# EasyEDA Pro project pcb.eprj

# Schematic Schematic1
Create Date: 2023-02-15; Page Name: P1; Project Name: pcb; Schematic Name: Schematic1; Update Date: 2023-03-15; Company: Shang Wentao; Page Size: A4; Version: V2.0
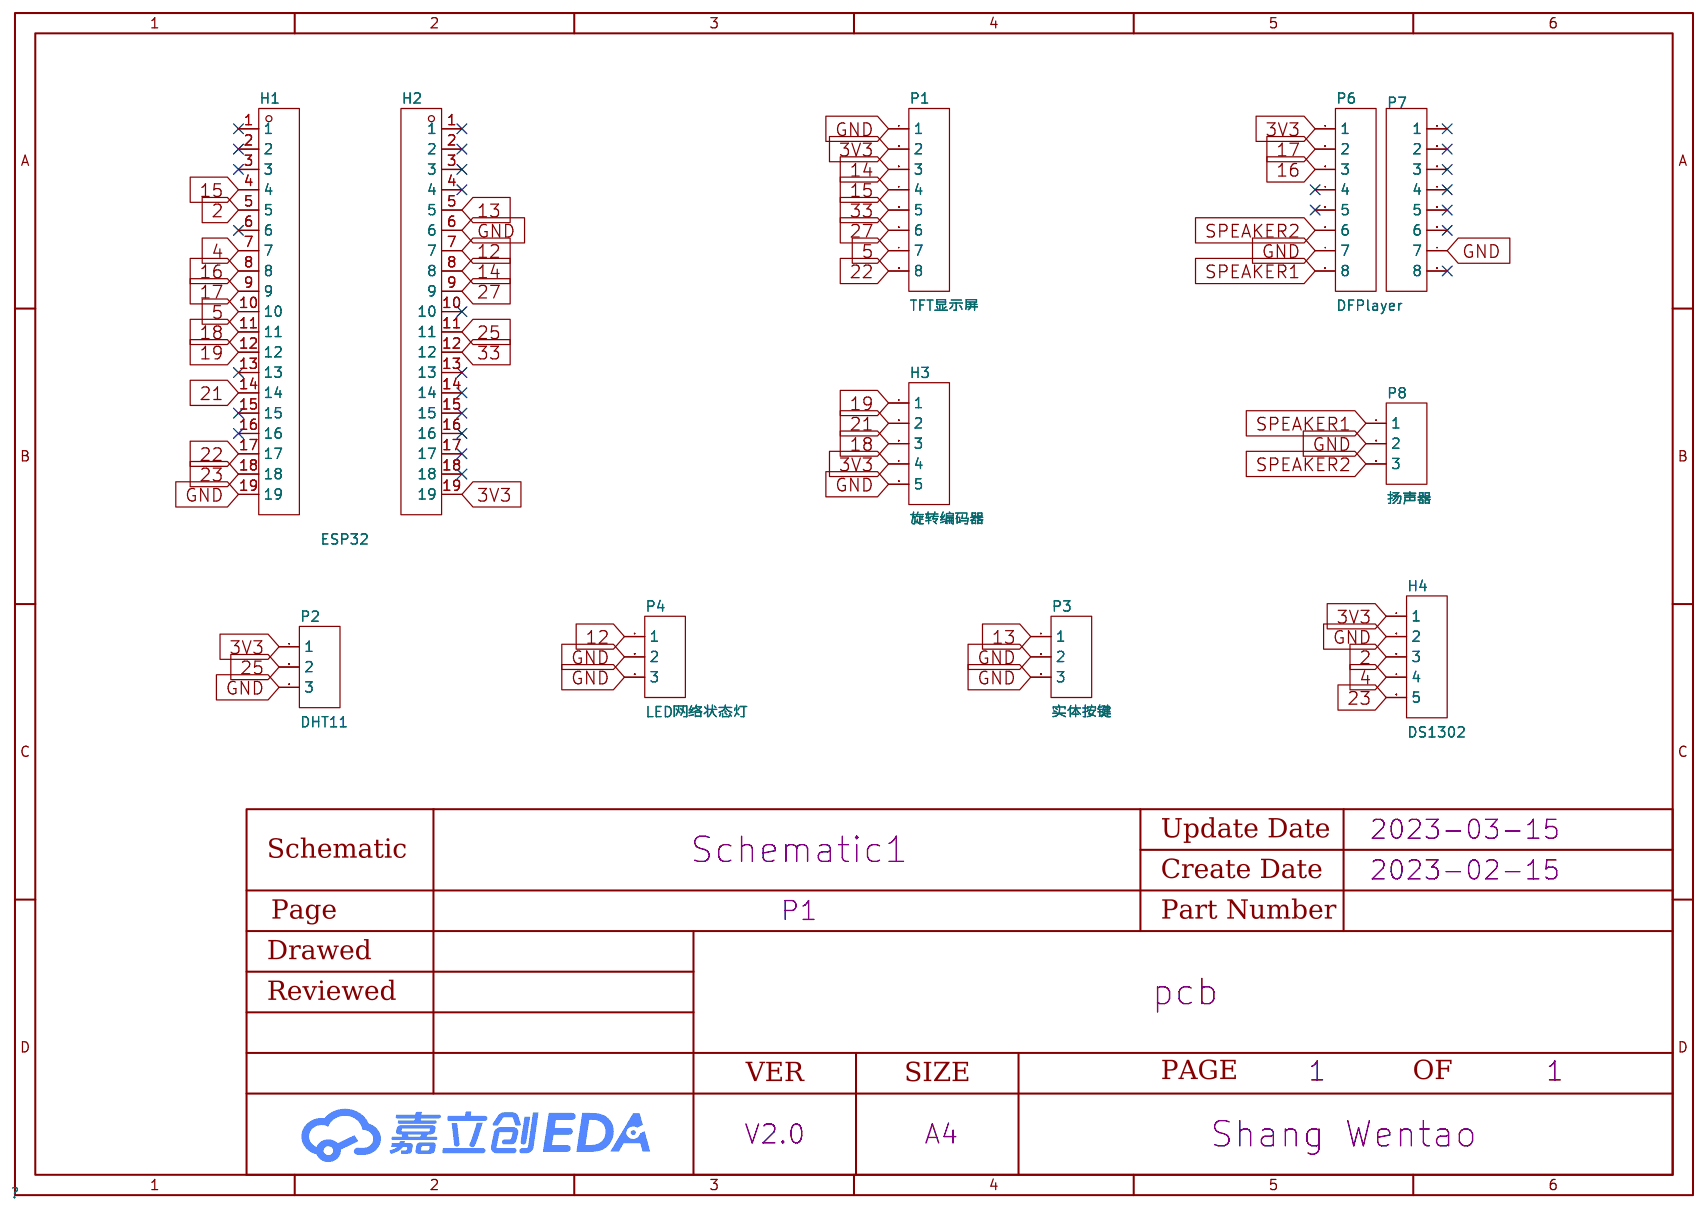
[diagram p0: schematic sheet]

## Parts
H1  ESP32  [HDR-TH_19P-P2.54-V-F]
H2  ESP32  [HDR-TH_19P-P2.54-V-F]
H3  旋转编码器  [HDR-TH_5P-P2.54-V-F]
H4  DS1302  [HDR-TH_5P-P2.54-V-F]
P1  TFT显示屏  [HDR-TH_8P-P2.54-V-F-1]
P2  DHT11  [HDR-TH_3P-P2.54-V-F]
P3  实体按键  [HDR-TH_3P-P2.54-V-F]
P4  LED网络状态灯  [HDR-TH_3P-P2.54-V-F]
P6  DFPlayer  [HDR-TH_8P-P2.54-V-F-1]
P7  2.54-1*8P母环保  [HDR-TH_8P-P2.54-V-F-1]
P8  扬声器  [HDR-TH_3P-P2.54-V-F]

## Library data of the parts
H1 H2 = 2.54-1*19P母: 排数:单排;总孔位数:19;间距:2.54mm;行距:-;安装类型:直插;塑高:-;触头材质:-;触头镀层:-;; LCSC Part Name: 2.54mm; Supplier Part: C319202; Manufacturer: BOOMELE(博穆精密); Supplier Footprint: 插件,P=2.54mm; JLCPCB Part Class: 扩展库; Supplier: LCSC; Number of Rows: 单排; Number of Holes: 19; Pitch: 2.54mm; Mounting Type: 直插
H3 H4 = 2.54-1*5P母: 排数:单排;总孔位数:5;间距:2.54mm;插孔结构:1x5P;行距:-;安装类型:直插;塑高:-;触头材质:-;触头镀层:-;; LCSC Part Name: 2.54mm 1x5P; Supplier Part: C50950; Manufacturer: BOOMELE(博穆精密); Supplier Footprint: 插件,P=2.54mm; JLCPCB Part Class: 扩展库; Datasheet: https://atta.szlcsc.com/upload/public/pdf/source/20151109/1457707571406.pdf; Supplier: LCSC; Number of Rows: 单排; Number of Holes: 5; Pitch: 2.54mm; Holes Structure: 1x5P; Mounting Type: 直插
P1 P6 P7 = 2.54-1*8P母环保: 排数:单排;总孔位数:8;间距:2.54mm;插孔结构:1x8P;行距:-;安装类型:直插;塑高:-;触头材质:-;触头镀层:-;; LCSC Part Name: 2.54mm 1x8P; Supplier Part: C27438; Manufacturer: BOOMELE(博穆精密); Supplier Footprint: 插件,P=2.54mm; JLCPCB Part Class: 扩展库; Datasheet: https://atta.szlcsc.com/upload/public/pdf/source/20151109/1457707554453.pdf; Supplier: LCSC; Number of Rows: 单排; Number of Holes: 8; Pitch: 2.54mm; Holes Structure: 1x8P; Mounting Type: 直插
P2-P4 P8 = 2.54-1*3P母: 排数:单排;总孔位数:3;间距:2.54mm;行距:-;安装类型:直插;塑高:-;触头材质:-;触头镀层:金;; LCSC Part Name: 2.54mm 环保镀金; Supplier Part: C146243; Manufacturer: BOOMELE(博穆精密); Supplier Footprint: 插件,P=2.54mm; JLCPCB Part Class: 扩展库; Supplier: LCSC; Number of Rows: 单排; Number of Holes: 3; Pitch: 2.54mm; Mounting Type: 直插; Contact Plating: 金

## Nets
3V3: H2.19 H3.4 H4.1 P1.2 P2.1 P6.1
GND: H1.19 H2.6 H3.5 H4.2 P1.1 P2.3 P3.2 P3.3 P4.2 P4.3 P6.7 P7.7 P8.2
2: H1.5 H4.3
4: H1.7 H4.4
5: H1.10 P1.7
12: H2.7 P4.1
13: H2.5 P3.1
14: H2.8 P1.3
15: H1.4 P1.4
16: H1.8 P6.3
17: H1.9 P6.2
18: H1.11 H3.3
19: H1.12 H3.1
21: H1.14 H3.2
22: H1.17 P1.8
23: H1.18 H4.5
25: H2.11 P2.2
27: H2.9 P1.6
33: H2.12 P1.5
SPEAKER1: P6.8 P8.1
SPEAKER2: P6.6 P8.3

Not connected (* = marked no-connect by the designer): H1 1* 2* 3* 6* 13* 15* 16*; H2 1* 2* 3* 4* 10* 13* 14* 15* 16* 17* 18*; P6 4* 5*; P7 1* 2* 3* 4* 5* 6* 8*

# Board PCB1
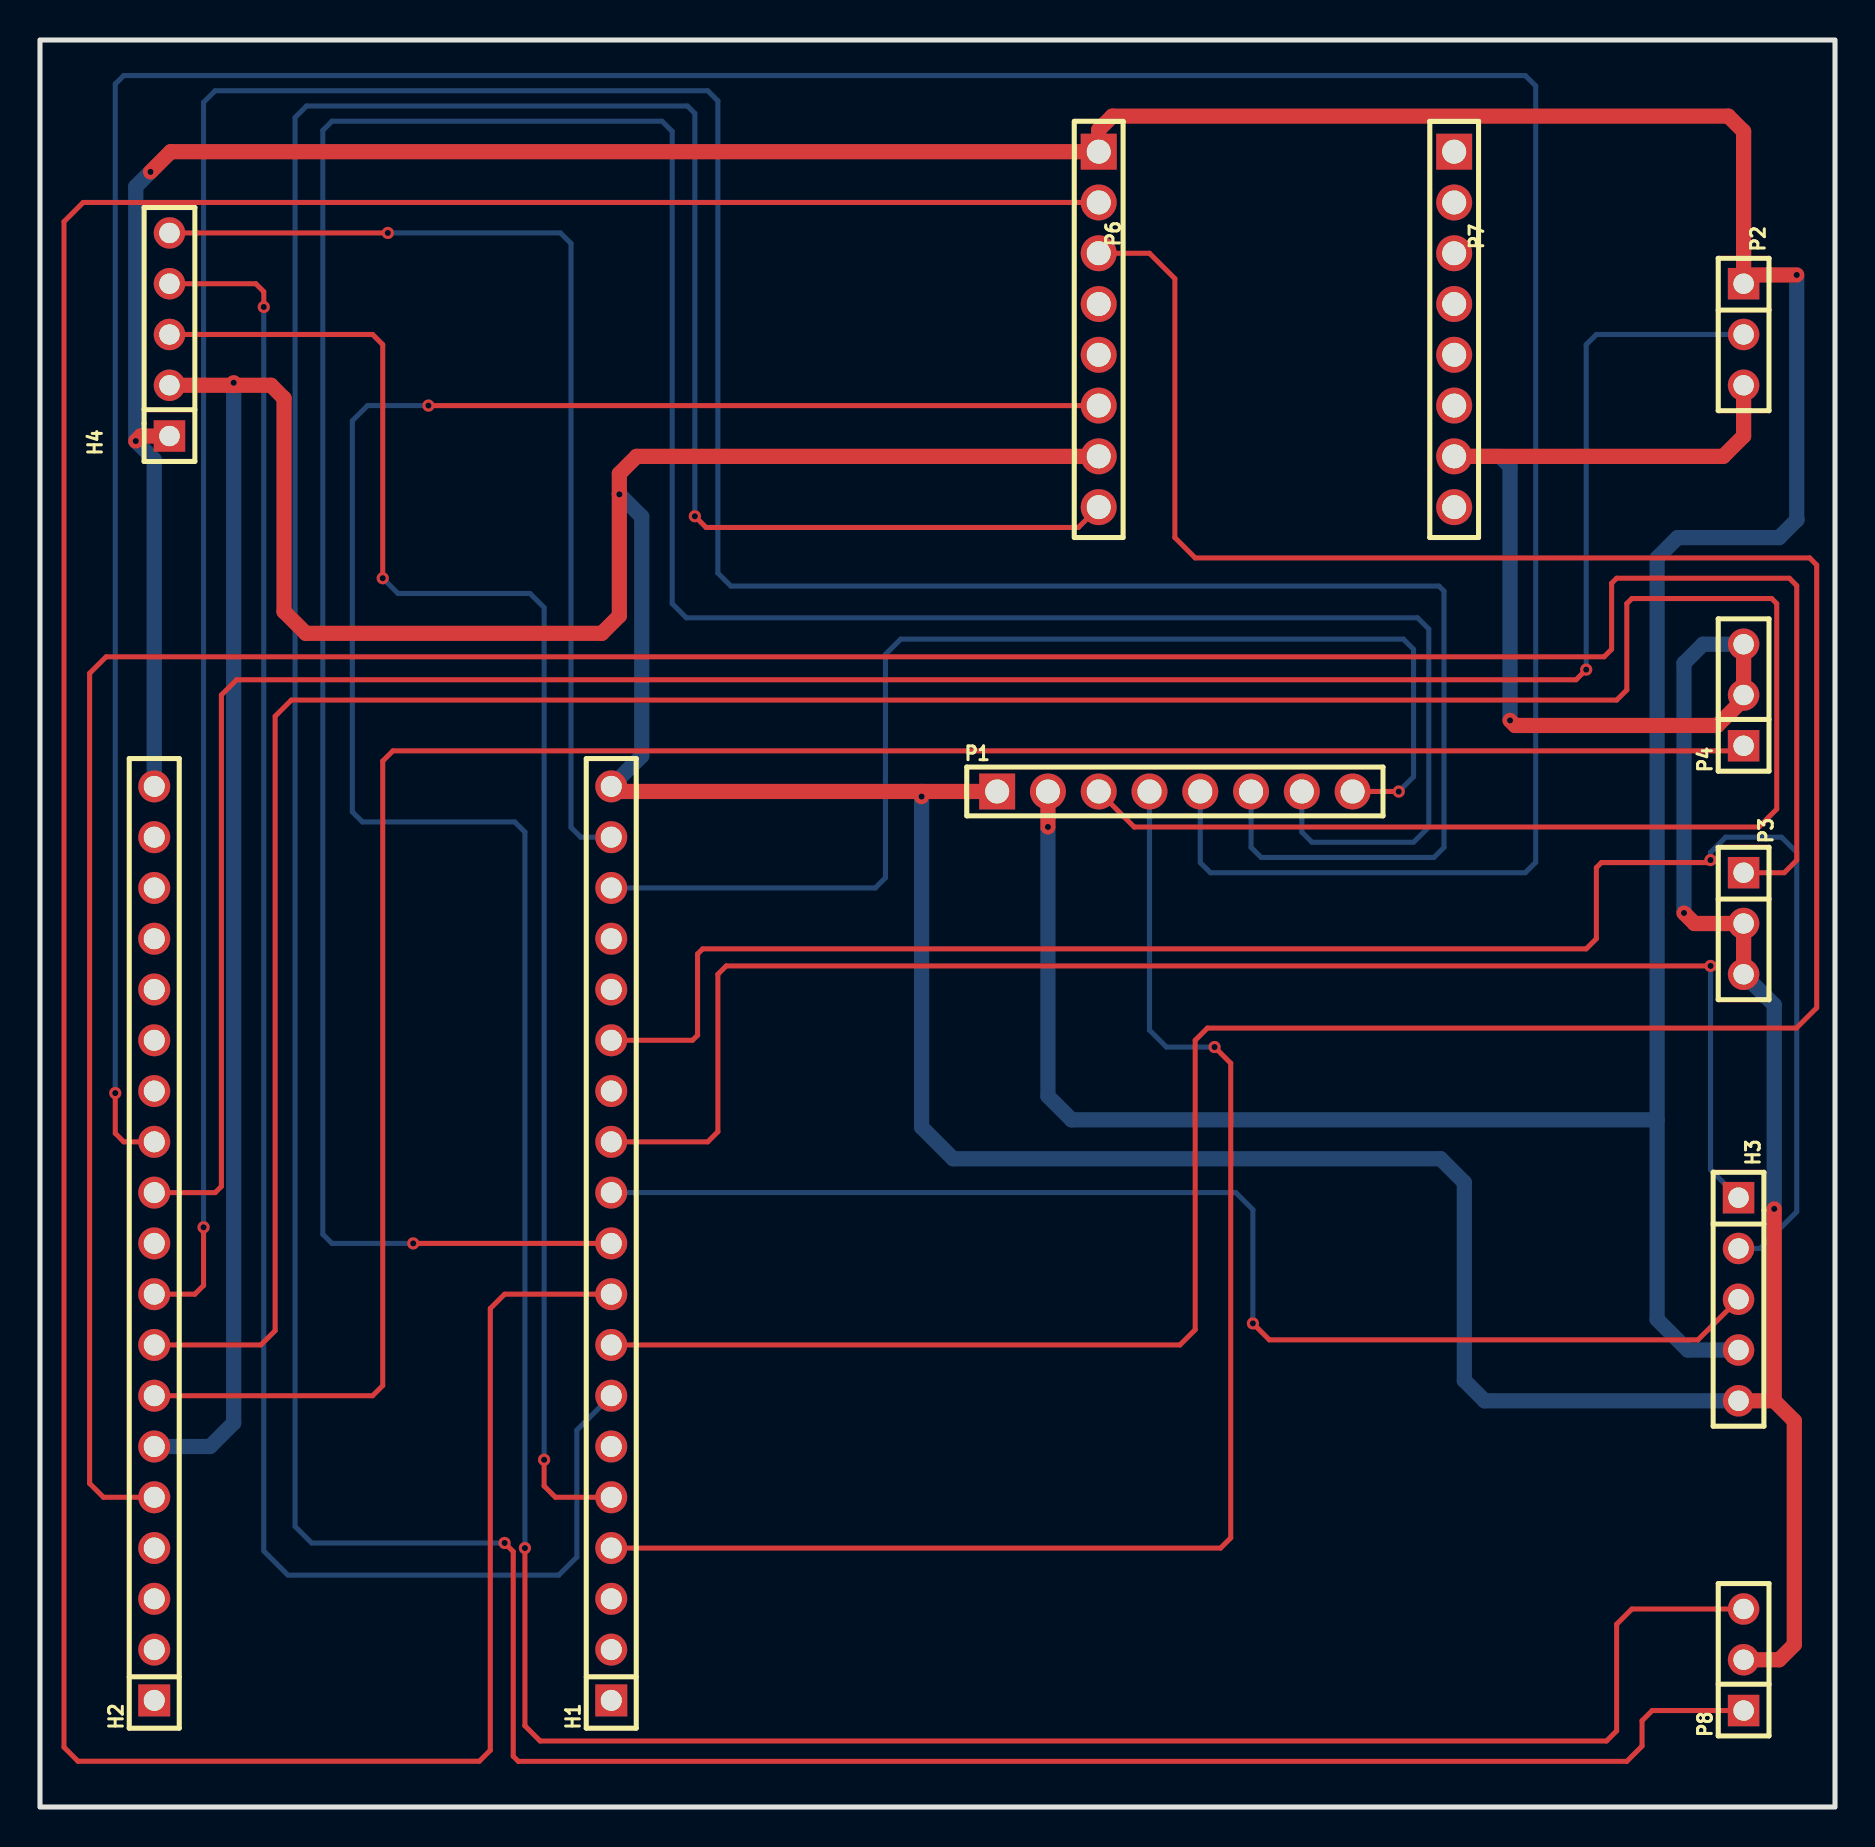
[diagram p1: board, top side]
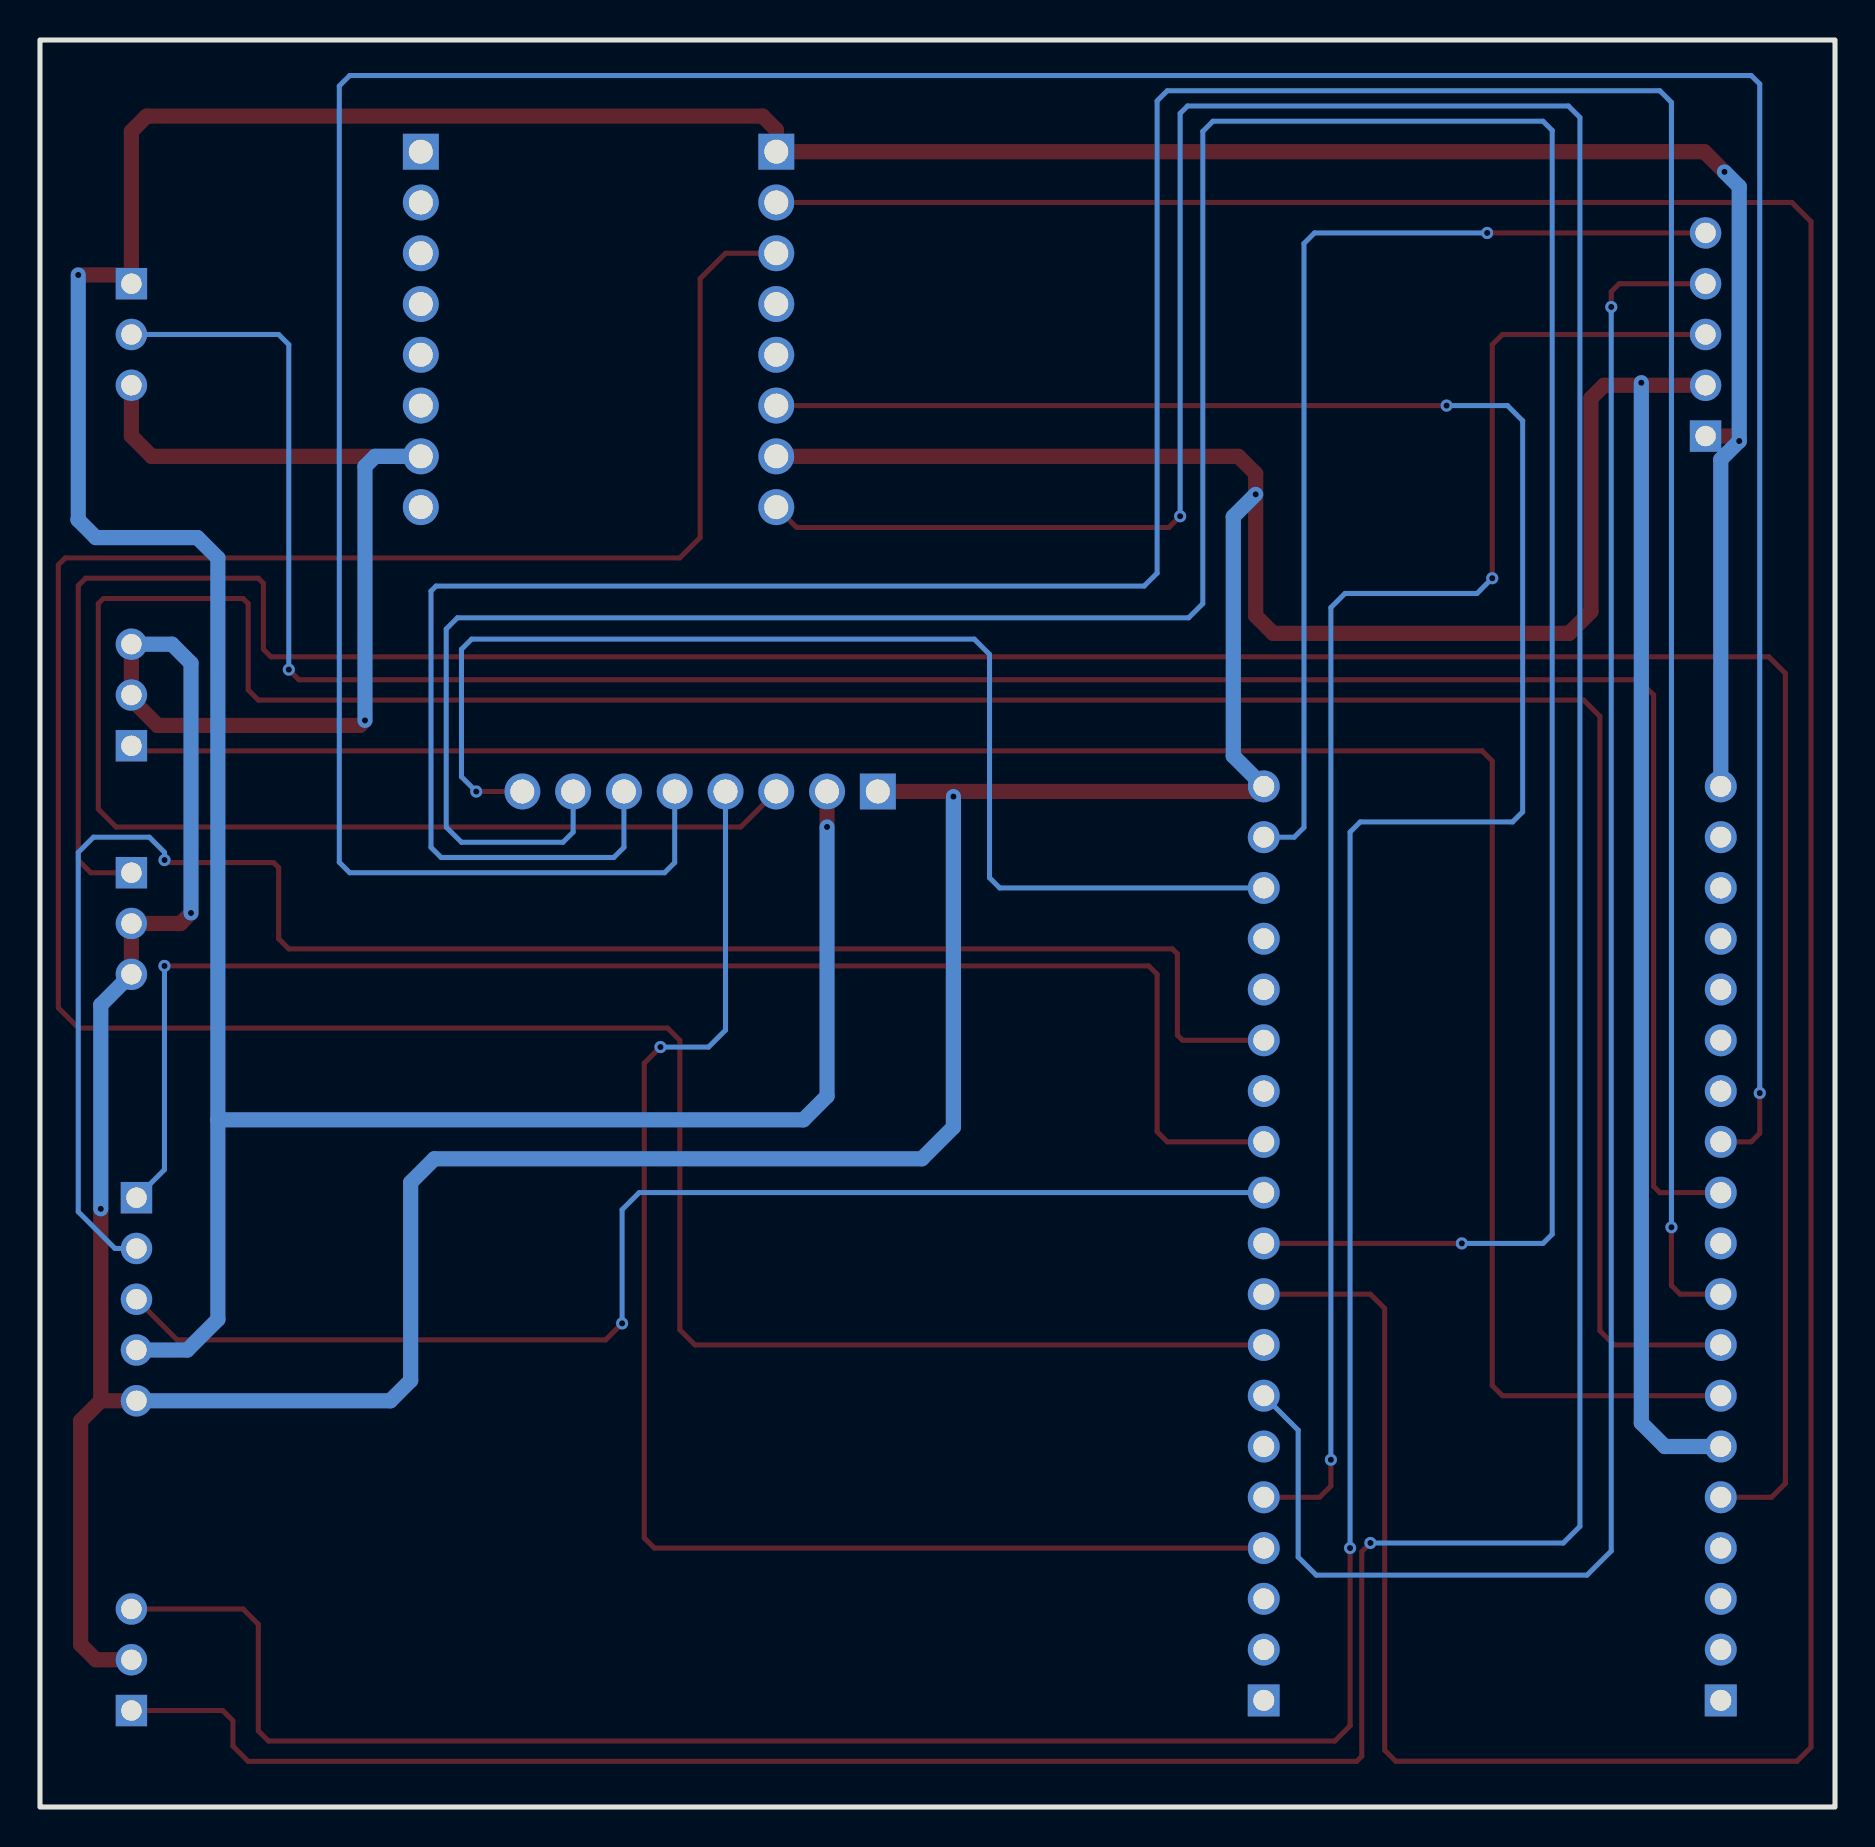
[diagram p2: board, bottom side, seen from below]

Outline 89.79 x 88.39 mm; copper layers: Top Layer, Bottom Layer. Coordinates in mm from the lower left corner of the outline.
Outline path: rectangle 0,88.39 89.79,0
Stack: Top Layer 0.035mm / Dielectric1 1.51mm FR4 er 4.5 / Bottom Layer 0.035mm

## Design rules (mm)
spacing safeClearance (default): track to track 0.254, other pairs 0.152 to 0.3
track width trackWidth (default): min 0.127, default 0.254, max 2.54
track width power: min 0.508, default 0.762, max 2.54
differential pair differentialPair (default): width min 0.127, default 0.254, max 2.54; gap min 0.152, default 0.152
via viaSize (default): diameter min 0.5, default 0.61, max 10; hole min 0.3, default 0.305, max 6
net GND uses power
net 3V3 uses power

## Placement (name value [footprint] x y rotation side)
H1  ESP32  [HDR-TH_19P-P2.54-V-F]  28.58 28.19 90 top
H2  ESP32  [HDR-TH_19P-P2.54-V-F]  5.72 28.19 90 top
H3  旋转编码器  [HDR-TH_5P-P2.54-V-F]  84.96 25.4 270 top
H4  DS1302  [HDR-TH_5P-P2.54-V-F]  6.48 73.66 90 top
P1  TFT显示屏  [HDR-TH_8P-P2.54-V-F-1]  56.77 50.8 0 top
P2  DHT11  [HDR-TH_3P-P2.54-V-F]  85.22 73.66 270 top
P3  实体按键  [HDR-TH_3P-P2.54-V-F]  85.22 44.2 270 top
P4  LED网络状态灯  [HDR-TH_3P-P2.54-V-F]  85.22 55.63 90 top
P6  DFPlayer  [HDR-TH_8P-P2.54-V-F-1]  52.96 73.91 270 top
P7  2.54-1*8P母环保  [HDR-TH_8P-P2.54-V-F-1]  70.74 73.91 270 top
P8  扬声器  [HDR-TH_3P-P2.54-V-F]  85.22 7.37 90 top

## Footprints (pads in the part's own frame, mm; a bottom-side part is the same pattern mirrored in y, then rotated)
HDR-TH_3P-P2.54-V-F
  rect 1.575x1.575 hole 1.02: 1(-2.54,0)
  round 1.575 hole 1.02: 2(0,0) 3(2.54,0)
HDR-TH_5P-P2.54-V-F
  rect 1.575x1.575 hole 1.02: 1(-5.08,0)
  round 1.575 hole 1.02: 2(-2.54,0) 3(0,0) 4(2.54,0) 5(5.08,0)
HDR-TH_8P-P2.54-V-F-1
  rect 1.8x1.8 hole 1.2: 1(-8.89,0)
  round 1.8 hole 1.2: 2(-6.35,0) 3(-3.81,0) 4(-1.27,0) 5(1.27,0) 6(3.81,0) 7(6.35,0) 8(8.89,0)
HDR-TH_19P-P2.54-V-F
  rect 1.6x1.6 hole 1.05: 1(-22.86,0)
  round 1.6 hole 1.05: 2(-20.32,0) 3(-17.78,0) 4(-15.24,0) 5(-12.7,0) 6(-10.16,0) 7(-7.62,0) 8(-5.08,0) 9(-2.54,0) 10(0,0) 11(2.54,0) 12(5.08,0) 13(7.62,0) 14(10.16,0) 15(12.7,0) 16(15.24,0) 17(17.78,0) 18(20.32,0) 19(22.86,0)

## Nets
As in the schematic.

Pads without a net: H1 1 2 3 6 13 15 16; H2 1 2 3 4 10 13 14 15 16 17 18; P6 4 5; P7 1 2 3 4 5 6 8

## Via types
v1: diameter 0.61, hole 0.305, Top Layer to Bottom Layer, 27 vias

## Routing (per net, layer and track width the routed paths; a pad name or vN(x,y) marks a point on that pad's centre or on a via; arc(x,y) is an arc through that point)
3V3: length 234.3
  Top Layer w0.762: v1(5.53,81.79) 6.54,82.8 P6.1 52.96,83.9 53.64,84.58 84.46,84.58 85.22,83.82 85.22,76.64 ; P2.1 85.22,76.64 ; 85.22,76.64 v1(87.87,76.64) ; v1(50.42,49.03) P1.2 ; H4.1 5.04,68.58 v1(4.79,68.33)
  Bottom Layer w0.762: H3.4 82.42,22.86 80.89,24.39 80.89,34.37 ; H2.19 5.72,67.41 v1(4.79,68.33) 4.79,81.06 v1(5.53,81.79) ; 80.89,34.37 80.89,62.48 81.91,63.5 87,63.5 87.88,64.39 87.87,64.4 v1(87.87,76.64) ; 80.89,34.37 51.6,34.37 50.42,35.56 v1(50.42,49.03)
GND: length 335.6
  Top Layer w0.762: v1(9.69,71.25) 9.69,71.12 ; 9.69,71.12 11.56,71.12 12.21,70.47 12.21,59.8 13.3,58.71 28.1,58.71 28.98,59.59 v1(28.98,65.66) 28.98,66.7 29.84,67.56 P6.7 ; 9.69,71.12 H4.2 ; v1(73.53,54.36) 73.79,54.1 83.9,54.1 85.22,55.41 P4.2 P4.3 ; 86.75,20.32 87.75,19.32 87.75,8.12 87,7.37 P8.2 ; 86.75,20.32 v1(86.75,29.92) ; 86.75,20.32 H3.5 ; H1.19 28.83,50.8 44.1,50.8 ; v1(82.24,44.72) 82.76,44.2 P3.2 P3.3 ; 44.1,50.8 P1.1 ; 44.1,50.8 v1(44.1,50.54) ; P7.7 84.2,67.56 85.22,68.58 P2.3
  Bottom Layer w0.762: v1(73.53,54.36) 73.53,67.06 73.03,67.56 P7.7 ; v1(28.98,65.66) 30.1,64.54 30.1,52.58 H1.19 ; H2.6 8.51,18.03 9.69,19.21 v1(9.69,71.25) ; H3.5 72.26,20.32 71.25,21.34 71.25,31.24 70.06,32.43 45.68,32.43 44.1,34.01 v1(44.1,50.54) ; P3.3 86.75,40.12 v1(86.75,29.92) ; v1(82.24,44.72) 82.24,57.22 83.19,58.17 P4.3
2: length 78.8
  Top Layer w0.254: H4.3 16.64,73.66 17.15,73.15 v1(17.15,61.47) ; H1.5 25.78,15.49 25.22,16.06 v1(25.22,17.37)
  Bottom Layer w0.254: v1(25.22,17.37) 25.22,60 24.51,60.71 17.91,60.71 v1(17.15,61.47)
4: length 93.2
  Top Layer w0.254: H4.4 10.8,76.2 11.19,75.8 v1(11.19,75.04)
  Bottom Layer w0.254: H1.7 26.85,18.85 26.85,12.5 25.95,11.6 12.4,11.6 11.19,12.81 v1(11.19,75.04)
5: length 168.5
  Top Layer w0.254: v1(18.67,28.19) H1.10
  Bottom Layer w0.254: v1(18.67,28.19) 14.61,28.19 14.15,28.65 14.15,83.87 14.61,84.33 31.12,84.33 31.62,83.82 31.62,60.2 32.33,59.49 68.91,59.49 69.47,58.93 69.47,49.02 68.71,48.26 63.63,48.26 63.12,48.77 P1.7
12: length 111.3
  Top Layer w0.254: P4.1 84.96,52.83 17.65,52.83 17.15,52.32 17.15,21.08 16.64,20.57 H2.7
13: length 150.1
  Top Layer w0.254: H2.5 3.17,15.49 2.48,16.19 2.48,56.71 3.31,57.54 78.24,57.54 78.61,57.91 78.61,61.21 78.87,61.47 87.5,61.47 87.87,61.1 87.87,47.36 87.25,46.74 P3.1
14: length 162.6
  Top Layer w0.254: P1.3 54.74,49.02 85.98,49.02 86.87,49.92 86.87,60.2 86.62,60.45 79.63,60.45 79.38,60.2 79.38,55.88 78.87,55.37 12.57,55.37 11.76,54.56 11.76,23.83 11.05,23.11 H2.8
15: length 71.6
  Top Layer w0.254: v1(58.75,38.02) 59.56,37.2 59.56,13.46 59.06,12.95 H1.4
  Bottom Layer w0.254: P1.4 55.5,38.86 56.34,38.02 v1(58.75,38.02)
16: length 147.9
  Top Layer w0.254: P6.3 55.5,77.72 56.77,76.45 56.77,63.5 57.78,62.48 88.52,62.48 88.87,62.13 88.87,39.98 87.86,38.96 58.4,38.96 57.78,38.35 57.78,23.88 57.02,23.11 H1.8
17: length 178.8
  Top Layer w0.254: H1.9 23.24,25.65 22.53,24.94 22.53,2.84 21.98,2.29 1.9,2.29 1.2,2.99 1.2,79.31 2.16,80.26 P6.2
18: length 63.6
  Top Layer w0.254: v1(60.67,24.19) 61.49,23.37 82.93,23.37 H3.3
  Bottom Layer w0.254: H1.11 59.82,30.73 60.67,29.88 v1(60.67,24.19)
19: length 75.4
  Top Layer w0.254: H1.12 33.4,33.27 33.91,33.78 33.91,41.66 34.33,42.07 v1(83.56,42.07)
  Bottom Layer w0.254: v1(83.56,42.07) 83.56,31.88 H3.1
21: length 90.2
  Top Layer w0.254: v1(83.56,47.37) 83.43,47.24 78.1,47.24 77.85,46.99 77.85,43.43 77.34,42.93 33.15,42.93 32.89,42.67 32.89,38.61 32.64,38.35 H1.14
  Bottom Layer w0.254: H3.2 86.04,27.94 87.87,29.78 87.87,47.75 87.11,48.51 84.32,48.51 83.56,47.75 v1(83.56,47.37)
22: length 61.8
  Top Layer w0.254: v1(67.97,50.8) 67.96,50.8 P1.8
  Bottom Layer w0.254: H1.17 41.78,45.97 42.29,46.48 42.29,57.66 43.05,58.42 68.2,58.42 68.71,57.91 68.71,51.54 v1(67.97,50.8)
23: length 51.7
  Top Layer w0.254: v1(17.4,78.74) H4.5
  Bottom Layer w0.254: v1(17.4,78.74) 26.03,78.74 26.56,78.21 26.56,49 27.05,48.51 H1.18
25: length 121.2
  Top Layer w0.254: H2.11 8.76,30.73 9.07,31.04 9.07,55.63 9.84,56.39 76.84,56.39 v1(77.34,56.9)
  Bottom Layer w0.254: P2.2 77.85,73.66 77.34,73.15 v1(77.34,56.9)
27: length 174
  Top Layer w0.254: v1(8.18,29) 8.18,26.09 7.75,25.65 H2.9
  Bottom Layer w0.254: P1.6 60.58,48.01 61.09,47.5 69.72,47.5 70.23,48.01 70.23,60.82 69.98,61.08 34.56,61.08 33.91,61.72 33.91,85.34 33.4,85.85 8.76,85.85 8.18,85.27 v1(8.18,29)
33: length 185.7
  Top Layer w0.254: H2.12 4.19,33.27 3.77,33.7 v1(3.77,35.71)
  Bottom Layer w0.254: v1(3.77,35.71) 3.77,86.19 4.19,86.61 74.3,86.61 74.82,86.09 74.82,47.26 74.3,46.74 58.55,46.74 58.04,47.24 P1.5
SPEAKER1: length 217
  Top Layer w0.254: P6.8 51.94,64.01 33.32,64.01 v1(32.76,64.57) ; P8.1 80.65,4.83 80.14,4.32 80.14,3.05 79.38,2.29 23.93,2.29 23.67,2.54 23.67,12.78 v1(23.24,13.21)
  Bottom Layer w0.254: v1(23.24,13.21) 13.59,13.21 12.76,14.04 12.76,84.51 13.34,85.09 32.38,85.09 32.76,84.72 v1(32.76,64.57)
SPEAKER2: length 178.1
  Top Layer w0.254: v1(19.43,70.1) P6.6 ; P8.3 79.63,9.91 78.87,9.14 78.87,3.81 78.36,3.3 25.02,3.3 24.26,4.06 v1(24.26,12.95)
  Bottom Layer w0.254: v1(24.26,12.95) 24.26,48.77 23.75,49.28 16.13,49.28 15.62,49.78 15.62,69.35 16.38,70.1 v1(19.43,70.1)
